# EAGLE schematic AC-DC-5V- Regulator (EAGLE 9.6.2)
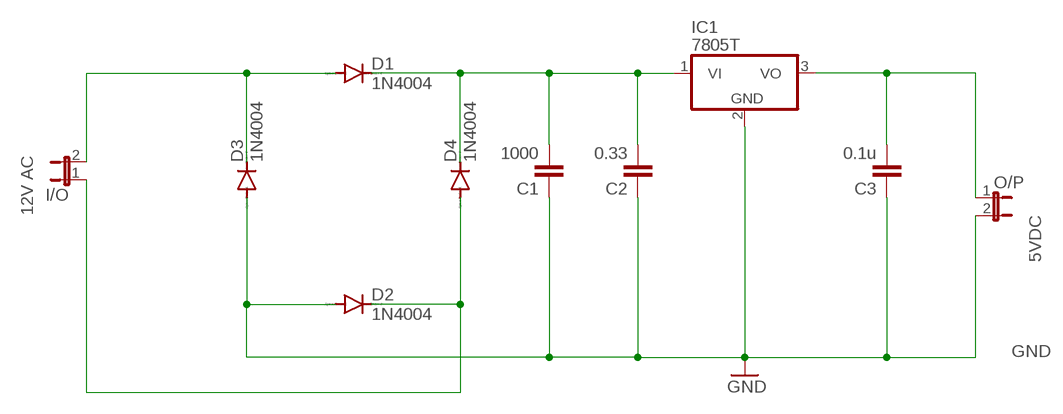
[diagram p0: schematic, sheet 1]

## Parts
C1  1000  C2,5-3  [C2.5-3]
C2  0.33  C2,5-3  [C2.5-3]
C3  0.1u  C2,5-3  [C2.5-3]
D1  1N4004  [DO41-10]
D2  1N4004  [DO41-10]
D3  1N4004  [DO41-10]
D4  1N4004  [DO41-10]
I/O  JP1E  [JP1]
IC1  7805T  [TO220H]
O/P  JP1E  [JP1]

## Nets
GND: C1.1 C2.1 C3.1 D2.A D3.A IC1.2(GND) O/P.2
N$1: D1.A D3.C I/O.2
N$3: D2.C D4.A I/O.1
N$4: C1.2 C2.2 D1.C D4.C IC1.1(VI)
N$5: C3.2 IC1.3(VO) O/P.1

## Library data of the parts
C1-C3 = capacitor-wima:C: CAPACITOR naming: grid - package width
D1-D4 = diode:1N4004: DIODE general purpose rectifier, 1 A
I/O O/P = jumper:JP1E: JUMPER
IC1 = linear:78*: Positive VOLTAGE REGULATOR Source: http://cache.national.com/ds/LM/LM78L05.pdf http://www.fairchildsemi.com/ds/LM/LM7805.pdf